# Altium project STM32F103C8T6.PrjPcb
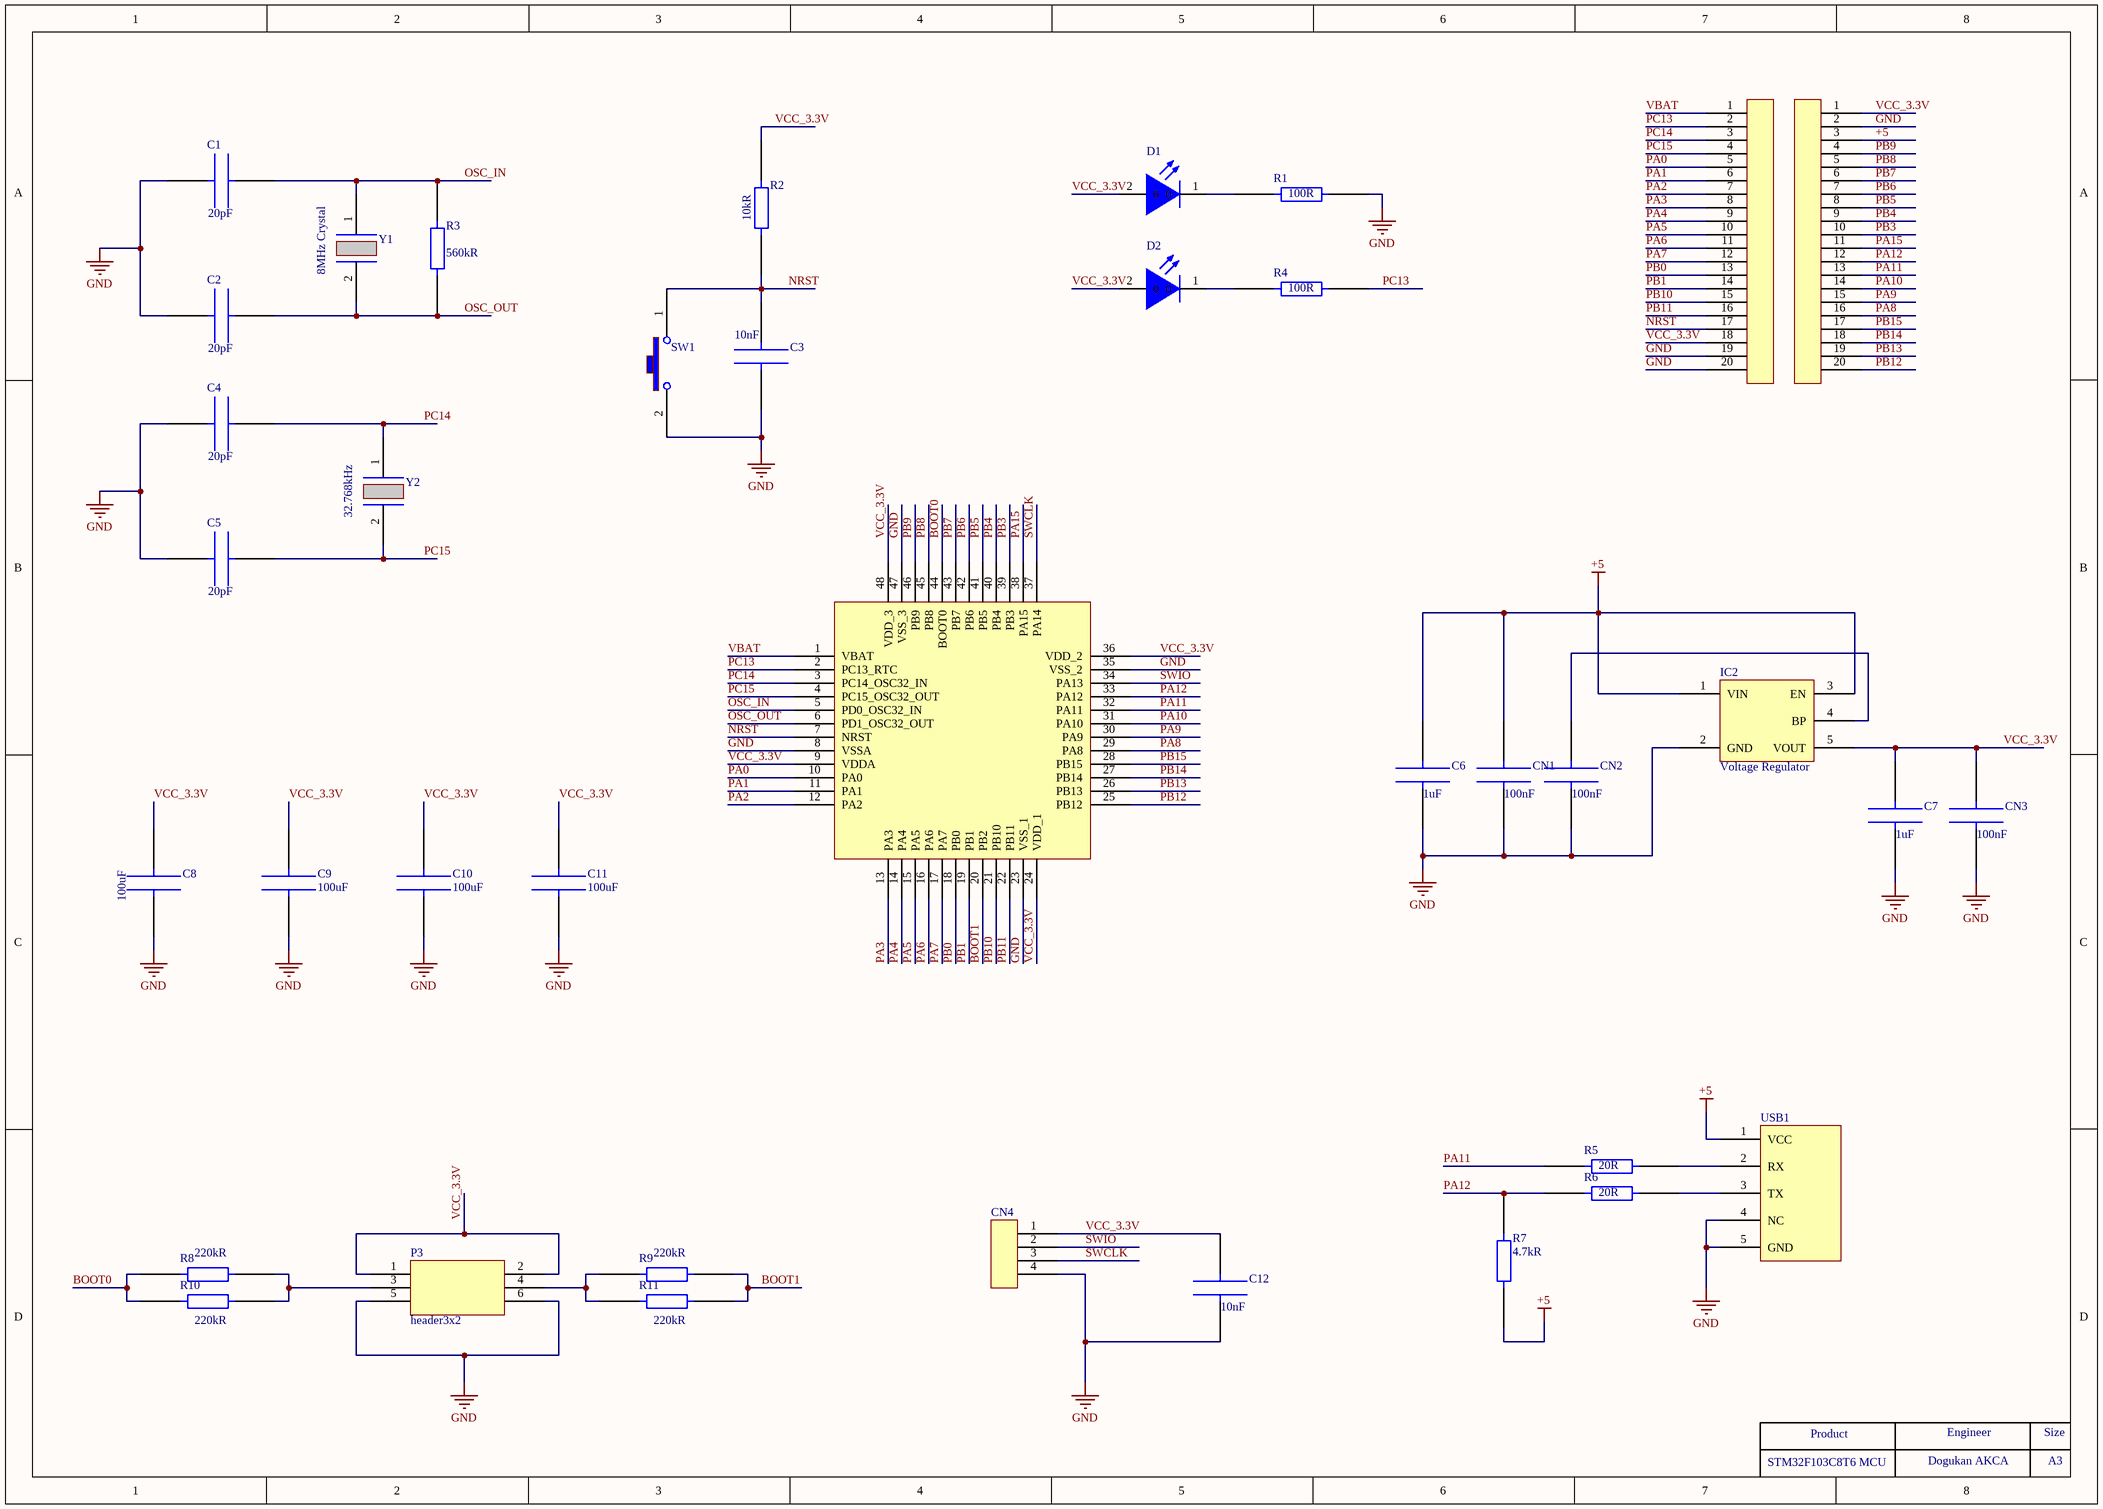
[diagram p0: STM32F103C8T6_Schematic.SchDoc]
1 sheet, 38 parts. Net scope: global (net labels, ports and power ports of the same name join across sheets).
Board file: STM32F103C8T6_PCB.PcbDoc

## Sheet STM32F103C8T6_Schematic.SchDoc
size A3

### Parts
C1  Capacitance: 20pF  [0603_CAP]  (hidden comment: CAP CER 20PF 50V C0G/NP0 0603)
C2  Capacitance: 20pF  [0603_CAP]  (hidden comment: CAP CER 20PF 50V C0G/NP0 0603)
C3  Capacitance: 10nF  [0603_CAP]  (hidden comment: CAP CER 10nF 50V X7R 0603)
C4  Capacitance: 20pF  [0603_CAP]  (hidden comment: CAP CER 20PF 50V C0G/NP0 0603)
C5  Capacitance: 20pF  [0603_CAP]  (hidden comment: CAP CER 20PF 50V C0G/NP0 0603)
C6  Capacitance: 1uF  [CAP_0805]  (hidden comment: CAP CER 1UF 0805)
C7  Capacitance: 1uF  [CAP_0805]  (hidden comment: CAP CER 1UF 0805)
C8  Capacitance: 100uF  [CAP_0805]  (hidden comment: CAP CER 100uf MLCC)
C9  Capacitance: 100uF  [CAP_0805]  (hidden comment: CAP CER 100uf MLCC)
C10  Capacitance: 100uF  [CAP_0805]  (hidden comment: CAP CER 100uf MLCC)
C11  Capacitance: 100uF  [CAP_0805]  (hidden comment: CAP CER 100uf MLCC)
C12  Capacitance: 10nF  [0603_CAP]  (hidden comment: CAP CER 10nF 50V X7R 0603)
CN1  Capacitance: 100nF  [0603_CAP]  (hidden comment: C0603 0.1uf)
CN2  Capacitance: 100nF  [0603_CAP]  (hidden comment: C0603 0.1uf)
CN3  Capacitance: 100nF  [0603_CAP]  (hidden comment: C0603 0.1uf)
CN4  CONN HDR STRIP SOLDER 4POS GOLD  [4 pin konnektor pin]  (value not drawn)
D1  LED GREEN CLEAR CHIP SMD  [0805_LED_GREEN]  (value not drawn)
D2  LED GREEN CLEAR CHIP SMD  [0805_LED_GREEN]  (value not drawn)
IC1  IC MCU 32BIT 64KB FLASH 48LQFP  [LQFP48]  (value not drawn)
IC2  Category: Voltage Regulator  [SOT23-5]  (hidden comment: IC REG LINEAR 3.3V 300MA SOT23-5)
P1  CONN SIL HDR MALE PIN 20POS TIN  [20pin1x20_header_connector]  (value not drawn)
P2  CONN SIL HDR MALE PIN 20POS TIN  [20pin1x20_header_connector]  (value not drawn)
P3  header3x2  [header3x2]
R1  100R  [0603_RES]
R2  Resistance: 10kR  [0603_RES]  (hidden comment: RES 10K OHM 0.5% 1/10W 0603)
R3  Resistance: 560kR  [0603_RES]  (hidden comment: RES 560K OHM 5% 1/10W 0603)
R4  100R  [0603_RES]
R5  R: 20R  [0603_RES]  (hidden comment: *RES 20 OHM 5% 1/10W 0603)
R6  R: 20R  [0603_RES]  (hidden comment: *RES 20 OHM 5% 1/10W 0603)
R7  Resistance: 4.7kR  [0603_RES]  (hidden comment: RES 4.7K OHM 5% 1/10W 0603)
R8  Resistance: 220kR  [0603_RES]  (hidden comment: RES 220K OHM 5% 1/10W 0603)
R9  Resistance: 220kR  [0603_RES]  (hidden comment: RES 220K OHM 5% 1/10W 0603)
R10  Resistance: 220kR  [0603_RES]  (hidden comment: RES 220K OHM 5% 1/10W 0603)
R11  Resistance: 220kR  [0603_RES]  (hidden comment: RES 220K OHM 5% 1/10W 0603)
SW1  push button switch  [push_button]  (value not drawn)
USB1  CONN RCPT USB2.0 MICRO B SMD R/A  [MICRO B USB2.0 SMD R/A]  (value not drawn)
Y1  Category: 8MHz Crystal  [USX SMD T_8MHz Crystal]  (hidden comment: CRYSTAL 8.0000MHZ 18PF SMD)
Y2  Frequency: 32.768kHz  [2-SMD_CRYSTAL 32.7680KHZ]  (hidden comment: CRYSTAL 32.7680KHZ 12.5PF SMD)

### Nets
+5: C6.2 CN1.2 IC2.1(VIN) IC2.3(EN) P2.3 R7.1 USB1.1(VCC)
GND: C1.1 C2.1 C3.1 C4.1 C5.1 C6.1 C7.1 C8.1 C9.1 C10.1 C11.1 C12.1 CN1.1 CN2.1 CN3.1 CN4.4 IC1.8(VSSA) IC1.23(VSS_1) IC1.35(VSS_2) IC1.47(VSS_3) IC2.2(GND) P1.19 P1.20 P2.2 P3.5 P3.6 R1.2 SW1.2 USB1.4(NC) USB1.5(GND)
BOOT0: IC1.44(BOOT0) R8.1 R10.1
BOOT1: IC1.20(PB2) R9.2 R11.2
NRST: C3.2 IC1.7(NRST) P1.17 R2.1 SW1.1
OSC_IN: C1.2 IC1.5(PD0_OSC32_IN) R3.2 Y1.1
OSC_OUT: C2.2 IC1.6(PD1_OSC32_OUT) R3.1 Y1.2
PA0: IC1.10(PA0) P1.5
PA1: IC1.11(PA1) P1.6
PA2: IC1.12(PA2) P1.7
PA3: IC1.13(PA3) P1.8
PA4: IC1.14(PA4) P1.9
PA5: IC1.15(PA5) P1.10
PA6: IC1.16(PA6) P1.11
PA7: IC1.17(PA7) P1.12
PA8: IC1.29(PA8) P2.16
PA9: IC1.30(PA9) P2.15
PA10: IC1.31(PA10) P2.14
PA11: IC1.32(PA11) P2.13 R5.1
PA12: IC1.33(PA12) P2.12 R6.1 R7.2
PA15: IC1.38(PA15) P2.11
PB0: IC1.18(PB0) P1.13
PB1: IC1.19(PB1) P1.14
PB3: IC1.39(PB3) P2.10
PB4: IC1.40(PB4) P2.9
PB5: IC1.41(PB5) P2.8
PB6: IC1.42(PB6) P2.7
PB7: IC1.43(PB7) P2.6
PB8: IC1.45(PB8) P2.5
PB9: IC1.46(PB9) P2.4
PB10: IC1.21(PB10) P1.15
PB11: IC1.22(PB11) P1.16
PB12: IC1.25(PB12) P2.20
PB13: IC1.26(PB13) P2.19
PB14: IC1.27(PB14) P2.18
PB15: IC1.28(PB15) P2.17
PC13: IC1.2(PC13_RTC) P1.2 R4.2
PC14: C4.2 IC1.3(PC14_OSC32_IN) P1.3 Y2.1
PC15: C5.2 IC1.4(PC15_OSC32_OUT) P1.4 Y2.2
SWCLK: CN4.3 IC1.37(PA14)
SWIO: CN4.2 IC1.34(PA13)
VBAT: IC1.1(VBAT) P1.1
VCC_3.3V: C7.2 C8.2 C9.2 C10.2 C11.2 C12.2 CN3.2 CN4.1 D1.2(0) D2.2(0) IC1.9(VDDA) IC1.24(VDD_1) IC1.36(VDD_2) IC1.48(VDD_3) IC2.5(VOUT) P1.18 P2.1 P3.1 P3.2 R2.2
NetCN2_2: CN2.2 IC2.4(BP)
NetD1_1: D1.1(0) R1.1
NetD2_1: D2.1(0) R4.1
NetP3_3: P3.3 R8.2 R10.2
NetP3_4: P3.4 R9.1 R11.1
NetR5_2: R5.2 USB1.2(RX)
NetR6_2: R6.2 USB1.3(TX)

### Notes on the sheet
- Product
- Dogukan AKCA
- Engineer
- Size
- A3
- STM32F103C8T6 MCU
- Title
- Size:
- Date:
- Number:
- Time:
- Revision:
- Sheet
- of
- File:

### Library data of the parts
C1 C2 C4 C5 = CAP CER 20PF 50V C0G/NP0 0603: Manufacturer: Samsung; Manufacturer Part Number: CL10C200JB8NNNC; Designer: Dogukan; Tolerance: 5%; Dielectric: C0G; Temperature Coefficient: 300ppm/°C; Supplier 1: Digi-Key; RoHS: Yes; Category: Ceramic Capacitors; Stock 1: 464918; Pricing 1: 1=0,1, 10=0,044, 50=0,0238, 100=0,0194, 500=0,01386, 1000=0,01089 (USD); Mount: Surface Mount; Case/Package: 0603; Case Code (Metric): 1608; Case Code (Imperial): 0603; Min Operating Temperature: -55°C; Max Operating Temperature: 125°C; Package Quantity: 1; Packaging: Tape and Reel; Voltage Rating: 50V; Voltage: 50V; Series: CL; Construction: Flat; Length: 1.6mm; Width: 0.031inch; Height: 0.8mm; Thickness: 0.035inch; Depth: 0.8mm; Radiation Hardening: No; RoHS Compliant: Yes; ComponentLink1URL: https://datasheet.ciiva.com/26877/getdatasheetpartid-640634-26877974.pdf?src-supplier=Verical; ComponentLink1Description: https://datasheet.ciiva.com/26877/getdatasheetpartid-640634-26877974.pdf?src-supplier=Verical; ComponentLink2URL: https://datasheet.ciiva.com/26310/mlcc-catalogdownload2013-eng-26310315.pdf?src-supplier=Distrelec; ComponentLink2Description: https://datasheet.ciiva.com/26310/mlcc-catalogdownload2013-eng-26310315.pdf?src-supplier=Distrelec; Supplier Part Number 1: 1276-1187-1-ND
C3 C12 = CAP CER 10nF 50V X7R 0603: Cap Ceramic 0.01uF 50V X7R 5% SMD 0603 125C Paper T/R; Manufacturer: Yageo; Manufacturer Part Number: CC0603JPX7R9BB103; Designer: Dogukan; Supplier 1: Digi-Key; RoHS: Yes; Category: Ceramic Capacitors; Stock 1: 51472; Pricing 1: 1=0,1, 10=0,048, 50=0,0262, 100=0,0214, 500=0,0153, 1000=0,01203, 2500=0,01093, 5000=0,01006 (USD); Case/Package: 0603; Case Code (Imperial): 0603; Case Code (Metric): 1608; Weight: 7.1E-05oz; Min Operating Temperature: -55°C; Max Operating Temperature: 125°C; Packaging: Tape and Reel; Voltage Rating (DC): 50V; Tolerance: 5%; Dielectric: X7R; Termination: SMD/SMT; Lead Free: Lead Free; Halogen Free: Halogen Free; RoHS Compliant: Yes; ComponentLink1URL: http://www.mouser.com/ds/2/447/UPY-GPHC_X7R_6.3V-to-50V_10-595240.pdf?src-supplier=Mouser; ComponentLink1Description: http://www.mouser.com/ds/2/447/UPY-GPHC_X7R_6.3V-to-50V_10-595240.pdf?src-supplier=Mouser; Supplier Part Number 1: 13-CC0603JPX7R9BB103CT-ND
C6 C7 = CAP CER 1UF 0805: CAP CER 1UF 50V X7R 0805; Manufacturer: Samsung; Manufacturer Part Number: CL21B105KBFNNNE; Designer: Dogukan; Tolerance: 10%; Supplier 1: Digi-Key; RoHS: Yes; Category: Ceramic Capacitors; Stock 1: 145892; Pricing 1: 1=0,11, 10=0,079, 50=0,045, 100=0,0373, 500=0,02616, 1000=0,02165 (USD); Mount: Surface Mount; Case/Package: 0805; Case Code (Metric): 2012; Case Code (Imperial): 0805; Min Operating Temperature: -55°C; Max Operating Temperature: 125°C; Packaging: Tape and Reel; Package Quantity: 1; Voltage Rating: 50V; Dielectric: X7R; Voltage: 50V; Series: CL; Construction: Flat; Length: 2mm; Width: 0.049inch; Height: 1.25mm; Thickness: 0.053inch; Depth: 1.25mm; Radiation Hardening: No; RoHS Compliant: Yes; ComponentLink1URL: https://datasheet.ciiva.com/25800/cl21b105kbfnnne-25800291.pdf?src-supplier=Digi-Key; ComponentLink1Description: https://datasheet.ciiva.com/25800/cl21b105kbfnnne-25800291.pdf?src-supplier=Digi-Key; Supplier Part Number 1: 1276-1029-1-ND
C8-C11 = CAP CER 100uf MLCC: Cap 100UF 4VDC Z6S 20% SMD 0805 Embossed Tape; Manufacturer: Murata; Manufacturer Part Number: GRM21BC80G107ME15K; Designer: Dogukan; Voltage Rating (DC): 4V; Dielectric: X6S; Supplier 1: Digi-Key; RoHS: Yes; Category: Ceramic Capacitors; Stock 1: 76129; Pricing 1: 1=0,94, 10=0,715, 50=0,5938, 100=0,5114, 500=0,3959, 1000=0,34092, 2500=0,31892, 5000=0,30243 (USD); Tolerance: 20%; Length: 2mm; Width: 1.25mm; Thickness: 1.25mm; RoHS Compliant: Yes; Supplier Part Number 1: 490-GRM21BC80G107ME15KCT-ND
CN1-CN3 = C0603 0.1uf: Multilayer Ceramic Capacitors (MLCC) - SMD/SMT 50volts 0.1uF X7R 10%; Manufacturer: KEMET; Manufacturer Part Number: C0603C104K5RACTU; Voltage Rating: 50V; Designer: Dogukan; Supplier 1: Digi-Key; RoHS: Yes; Category: Ceramic Capacitors; Stock 1: 9369813; Pricing 1: 1=0,11, 10=0,078, 50=0,0424, 100=0,0346, 500=0,02474, 1000=0,01944 (USD); Mount: Surface Mount; Case/Package: 0603; Min Operating Temperature: -55°C; Max Operating Temperature: 125°C; Tolerance: 10%; Packaging: Tape and Reel; Dielectric: X7R; Series: SMD Comm X7R; Voltage: 50V; Length: 0.063inch; Width: 0.031inch; Thickness: 0.034inch; RoHS Compliant: Yes; Supplier Part Number 1: 399-C0603C104K5RAC7867CT-ND
CN4 = KONNEKTOR 4POS: Headers & Wire Housings Low Profile RT Angle Solder Cup Header; Manufacturer: Mill-Max; Manufacturer Part Number: 380-10-104-10-003000; Designer: Dogukan; Supplier 1: Digi-Key; RoHS: No; Category: Connectors; Stock 1: 609; Pricing 1: 1=6,26, 10=5,684, 100=5,0076, 500=4,25644, 1000=3,6305 (USD); ComponentLink1URL: https://www.mill-max.com/assets/pdfs/047.2.PDF?src-supplier=Digi-Key; ComponentLink1Description: https://www.mill-max.com/assets/pdfs/047.2.PDF?src-supplier=Digi-Key; ComponentLink2URL: https://datasheet.octopart.com/380-10-104-10-003000-Mill-Max-datasheet-155418866.pdf?src-supplier=Sager+Electronics; ComponentLink2Description: https://datasheet.octopart.com/380-10-104-10-003000-Mill-Max-datasheet-155418866.pdf?src-supplier=Sager+Electronics; Supplier Part Number 1: ED10093-ND
D1 D2 = LED GREEN CLEAR CHIP SMD: Green 569nm LED Indication - Discrete 2.1V 0805 (2012 Metric); Manufacturer: Vishay Lite-On; Manufacturer Part Number: LTST-C171GKT; Designer: Dogukan; Lens Color: Colorless; Viewing Angle: 130°; Lens Style: Flat,Diffused,Colorless,Rectangular,Clear; Luminous Intensity: 12mcd; Forward Current: 30mA; Power Rating: 100mW; Test Current: 10mA; Number of Elements: 1; Wavelength: 585nm; Reverse Voltage: 5V; Lens Size: 1.25mm; Supplier 1: Digi-Key; RoHS: Yes; Category: LEDs; Stock 1: 213944; Pricing 1: 1=0,26, 10=0,143, 100=0,0663, 500=0,0612, 1000=0,04794 (USD); Mount: Surface Mount; Case/Package: 0805; Number of Pins: 2; Color: Green; Case Code (Metric): 2012; Case Code (Imperial): 0805; Min Operating Temperature: -55°C; Max Operating Temperature: 85°C; Package Quantity: 3000; Packaging: Tape and Reel; Forward Voltage: 2.1V; Illumination Color: Green; Dominant Wavelength: 569nm; Lens Transparency: Clear; Power Dissipation: 100mW; Number of LEDs: 1; Series: -; Length: 2mm; Width: 1.25mm; Height: 0.9mm; Depth: 1.25mm; Radiation Hardening: No; Lead Free: Lead Free; RoHS Compliant: Yes; ComponentLink1URL: https://datasheet.ciiva.com/11773/0900766b80dc0296-11773991.pdf?src-supplier=Rs; ComponentLink1Description: https://datasheet.ciiva.com/11773/0900766b80dc0296-11773991.pdf?src-supplier=Rs; ComponentLink2URL: https://datasheet.ciiva.com/2110/ltst-c171gkt-2110000.pdf?src-supplier=Digi-Key; ComponentLink2Description: https://datasheet.ciiva.com/2110/ltst-c171gkt-2110000.pdf?src-supplier=Digi-Key; ComponentLink3URL: https://datasheet.ciiva.com/12400/lite-on-ltst-c171gkt-190133-12400647.pdf?src-supplier=Mouser; ComponentLink3Description: https://datasheet.ciiva.com/12400/lite-on-ltst-c171gkt-190133-12400647.pdf?src-supplier=Mouser; ComponentLink4URL: https://datasheet.ciiva.com/2110/ltst-c171gkt-2110001.pdf?src-supplier=Digi-Key; ComponentLink4Description: https://datasheet.ciiva.com/2110/ltst-c171gkt-2110001.pdf?src-supplier=Digi-Key; ComponentLink5URL: https://datasheet.ciiva.com/2110/ltst-c171gkt-2110002.pdf?src-supplier=Digi-Key; ComponentLink5Description: https://datasheet.ciiva.com/2110/ltst-c171gkt-2110002.pdf?src-supplier=Digi-Key; ComponentLink6URL: https://datasheet.ciiva.com/16396/ltst-c171gkt-16396549.pdf?src-supplier=Future+Electronics; ComponentLink6Description: https://datasheet.ciiva.com/16396/ltst-c171gkt-16396549.pdf?src-supplier=Future+Electronics; Supplier Part Number 1: 160-1423-1-ND
IC1 = STM32F103C8T6: ARM Cortex-M3 STM32 F1 Microcontroller 32-Bit 72MHz 64kB FLASH LQFP48 STM32F103C8T6; Manufacturer: STMicroelectronics; Designer: Dogukan; ComponentLink1URL: https://datasheet.ciiva.com/8054/1730126-8054942.pdf?src-supplier=Element14; ComponentLink1Description: https://datasheet.ciiva.com/8054/1730126-8054942.pdf?src-supplier=Element14; ComponentLink2URL: https://datasheet.ciiva.com/14100/pustm-arm-microcont-stm32f103-en-14100508.pdf?src-supplier=Distrelec; ComponentLink2Description: https://datasheet.ciiva.com/14100/pustm-arm-microcont-stm32f103-en-14100508.pdf?src-supplier=Distrelec; Supplier 1: Digi-Key; RoHS: Yes; Category: Microcontrollers; Pricing 1: 1=6,42, 25=5,5256, 100=4,7979, 500=4,17798, 2500=3,5672 (USD); Supplier Part Number 1: 497-6063-ND; Manufacturer Part Number: STM32F103C8T6
IC2 = Voltage Regulator_5V->3.3V: IC REG LDO 3.3V 0.3A SOT23-5; Manufacturer: Richtek; Manufacturer Part Number: RT9193-33GB; Designer: Dogukan; Supplier 1: Digi-Key; RoHS: Yes; Stock 1: 15060; Pricing 1: 1=0,55, 10=0,468, 25=0,4368, 100=0,3494, 250=0,32448, 500=0,27456, 1000=0,21216 (USD); ComponentLink1URL: https://datasheet.ciiva.com/2046/3d3futf-83fb3frfm5mtkzlte2lnbkzg3d3d3f3d-2046896.pdf?src-supplier=Digi-Key; ComponentLink1Description: https://datasheet.ciiva.com/2046/3d3futf-83fb3frfm5mtkzlte2lnbkzg3d3d3f3d-2046896.pdf?src-supplier=Digi-Key; ComponentLink2URL: https://datasheet.ciiva.com/28652/1782157-28652989.pdf?src-supplier=Element14; ComponentLink2Description: https://datasheet.ciiva.com/28652/1782157-28652989.pdf?src-supplier=Element14; Supplier Part Number 1: 1028-1014-1-ND
P1 P2 = header_20pin: 2.54mm (0.1") Pitch SIL Vertical Through Connect Header Strip, tin (hi-temp mould), 20 contacts; Manufacturer: Harwin; Manufacturer Part Number: D01-9922046; Designer: Dogukan; Supplier 1: Digi-Key; RoHS: Yes; Category: Headers and Wire Housings; Stock 1: 1140; Pricing 1: 1=4,9, 100=3,1066, 500=2,6656, 2500=2,37161 (USD); ComponentLink1URL: https://datasheet.ciiva.com/9479/d01-992-9479968.pdf?src-supplier=Avnet; ComponentLink1Description: https://datasheet.ciiva.com/9479/d01-992-9479968.pdf?src-supplier=Avnet; ComponentLink2URL: https://datasheet.ciiva.com/11747/0900766b8078dcb7-11747631.pdf?src-supplier=Rs; ComponentLink2Description: https://datasheet.ciiva.com/11747/0900766b8078dcb7-11747631.pdf?src-supplier=Rs; ComponentLink3URL: https://datasheet.ciiva.com/7639/111680-7639719.pdf?src-supplier=Element14; ComponentLink3Description: https://datasheet.ciiva.com/7639/111680-7639719.pdf?src-supplier=Element14; ComponentLink4URL: https://datasheet.ciiva.com/6783/d01-992-6783401.pdf?src-supplier=Digi-Key; ComponentLink4Description: https://datasheet.ciiva.com/6783/d01-992-6783401.pdf?src-supplier=Digi-Key; Supplier Part Number 1: 952-1900-ND
P3 = header3x2: Designer: Dogukan
R1 R4 = RES_100R_0603: Res Thick Film 0603 100 Ohm 1% 1/10W ±100ppm/°C Molded SMD Paper T/R; Manufacturer: Yageo; Manufacturer Part Number: RC0603FR-07100RL; Designer: Dogukan; Max Power Dissipation: 100mW; Voltage Rating (DC): 50V; Supplier 1: Digi-Key; RoHS: Yes; Category: Chip SMD Resistors; Stock 1: 7267655; Pricing 1: 1=0,1, 10=0,018, 50=0,0106, 100=0,0088, 500=0,00592, 1000=0,00505 (USD); Case/Package: 0603; Number of Pins: 2; Case Code (Imperial): 0603; Case Code (Metric): 1608; Size Code: 0603; Min Operating Temperature: -55°C; Max Operating Temperature: 155°C; Resistance: 100R; Tolerance: 1%; Packaging: Tape and Reel; Temperature Coefficient: 100ppm/°C; Series: RC; Number of Terminations: 2; Features: Moisture Resistant; Power Rating: 100mW; Termination: SMD/SMT; Voltage Rating: 50V; Resistor Type: Thick Film; Construction: Rectangular; Technology: THICK FILM; Resistance Tolerance: 1%; Length: 1.6mm; Width: 0.8mm; Height: 0.45mm; Depth: 0.8mm; RoHS Compliant: Yes; Lead Free: Lead Free; Military Standard: Not; Reach SVHC Compliant: Unknown; ComponentLink1URL: https://datasheet.ciiva.com/7660/38590-7660788.pdf?src-supplier=Element14; ComponentLink1Description: https://datasheet.ciiva.com/7660/38590-7660788.pdf?src-supplier=Element14; ComponentLink2URL: https://datasheet.ciiva.com/11808/0900766b80f96399-11808280.pdf?src-supplier=Rs; ComponentLink2Description: https://datasheet.ciiva.com/11808/0900766b80f96399-11808280.pdf?src-supplier=Rs; ComponentLink3URL: https://datasheet.ciiva.com/22747/443971-22747518.pdf?src-supplier=Element14; ComponentLink3Description: https://datasheet.ciiva.com/22747/443971-22747518.pdf?src-supplier=Element14; ComponentLink4URL: https://datasheet.ciiva.com/46440/1868787-46440890.pdf?src-supplier=Element14; ComponentLink4Description: https://datasheet.ciiva.com/46440/1868787-46440890.pdf?src-supplier=Element14; ComponentLink5URL: https://datasheet.ciiva.com/7746/1738695-7746238.pdf?src-supplier=Element14; ComponentLink5Description: https://datasheet.ciiva.com/7746/1738695-7746238.pdf?src-supplier=Element14; ComponentLink6URL: https://datasheet.ciiva.com/7746/1738695-7746237.pdf?src-supplier=Element14; ComponentLink6Description: https://datasheet.ciiva.com/7746/1738695-7746237.pdf?src-supplier=Element14; Supplier Part Number 1: 311-100HRDKR-ND
R2 = RES 10K OHM 0.5% 1/10W 0603: Res Thin Film 0603 10K Ohm 0.5% 1/10W ±25ppm/°C Molded SMD Paper T/R; Manufacturer: Yageo; Manufacturer Part Number: RT0603DRD0710KL; Designer: Dogukan; Power Rating: 100mW; Voltage Rating (DC): 50V; Supplier 1: Digi-Key; RoHS: Yes; Category: Chip SMD Resistors; Stock 1: 1584873; Pricing 1: 1=0,18, 10=0,151, 100=0,0592, 500=0,0358, 1000=0,02478, 2500=0,02271 (USD); Case/Package: 0603; Case Code (Imperial): 0603; Case Code (Metric): 1608; Size Code: 0603; Min Operating Temperature: -55°C; Max Operating Temperature: 155°C; Tolerance: 0.5%; Packaging: Cut Tape; Temperature Coefficient: 25ppm/°C; Series: RT; Max Power Dissipation: 100mW; Number of Terminations: 2; Width: 800um; Lead Free: Lead Free; RoHS Compliant: Yes; ComponentLink1URL: http://www.yageo.com/documents/recent/PYu-RT_1-to-0.01_RoHS_L_9.pdf?src-supplier=Digi-Key; ComponentLink1Description: http://www.yageo.com/documents/recent/PYu-RT_1-to-0.01_RoHS_L_9.pdf?src-supplier=Digi-Key; ComponentLink2URL: http://www.yageo.com/documents/recent/PYu-RT_1-to-0.05_RoHS_L_(4).pdf?src-supplier=Future+Electronics; ComponentLink2Description: http://www.yageo.com/documents/recent/PYu-RT_1-to-0.05_RoHS_L_(4).pdf?src-supplier=Future+Electronics; Supplier Part Number 1: 311-10KDCT-ND
R3 = RES 560K OHM 5% 1/10W 0603: Res Thick Film 0603 560K Ohm 5% 0.1W(1/10W) ±100ppm/C Molded SMD Paper T/R; Manufacturer: Yageo; Manufacturer Part Number: RC0603JR-07560KL; Designer: Dogukan; Power Rating: 100mW; Voltage Rating: 75V; Voltage Rating (DC): 50V; Temperature Coefficient: 100ppm/°C; Supplier 1: Digi-Key; RoHS: Yes; Category: Chip SMD Resistors; Stock 1: 503891; Pricing 1: 1=0,1, 10=0,014, 50=0,0088, 100=0,0073, 500=0,00486, 1000=0,00415 (USD); Case/Package: 0603; Number of Pins: 2; Case Code (Metric): 1608; Case Code (Imperial): 0603; Weight: 7.1E-05oz; Min Operating Temperature: -55°C; Max Operating Temperature: 155°C; Package Quantity: 1; Tolerance: 5%; Packaging: Tape and Reel; Resistor Type: Thick Film; Number of Terminations: 2; Termination: SMD/SMT; Max Power Dissipation: 100mW; Working Voltage: 75V; Features: Moisture Resistant; Series: RC; Resistance Tolerance: 5%; Technology: THICK FILM; Length: 0.063inch; Width: 0.8mm; Height: 0.022inch; Lead Free: Lead Free; RoHS Compliant: Yes; Reach SVHC Compliant: Unknown; ComponentLink1URL: https://datasheet.ciiva.com/2453/pyu-r-int-thick-7-2453056.pdf?src-supplier=Digi-Key; ComponentLink1Description: https://datasheet.ciiva.com/2453/pyu-r-int-thick-7-2453056.pdf?src-supplier=Digi-Key; ComponentLink2URL: https://datasheet.ciiva.com/2453/pyu-r-int-thick-7-2453057.pdf?src-supplier=Digi-Key; ComponentLink2Description: https://datasheet.ciiva.com/2453/pyu-r-int-thick-7-2453057.pdf?src-supplier=Digi-Key; ComponentLink3URL: https://datasheet.ciiva.com/2453/pyu-r-int-thick-7-2453055.pdf?src-supplier=Digi-Key; ComponentLink3Description: https://datasheet.ciiva.com/2453/pyu-r-int-thick-7-2453055.pdf?src-supplier=Digi-Key; Supplier Part Number 1: 311-560KGRCT-ND
R5 R6 = RES 20 OHM 5% 1/10W 0603: Res Thick Film 0603 20 Ohm 5% 1/10W +/-100ppm/ßC Molded SMD Paper T/R; Manufacturer: Yageo; Manufacturer Part Number: RC0603JR-0720RL; Designer: Dogukan; Supplier 1: Digi-Key; RoHS: Yes; Category: Chip SMD Resistors; Stock 1: 1380627; Pricing 1: 1=0,1, 10=0,014, 50=0,0088, 100=0,0073, 500=0,00486, 1000=0,00415 (USD); ComponentLink1URL: https://datasheet.ciiva.com/2453/pyu-r-int-thick-7-2453211.pdf?src-supplier=Digi-Key; ComponentLink1Description: https://datasheet.ciiva.com/2453/pyu-r-int-thick-7-2453211.pdf?src-supplier=Digi-Key; ComponentLink2URL: https://datasheet.ciiva.com/2453/pyu-r-int-thick-7-2453212.pdf?src-supplier=Digi-Key; ComponentLink2Description: https://datasheet.ciiva.com/2453/pyu-r-int-thick-7-2453212.pdf?src-supplier=Digi-Key; ComponentLink3URL: https://datasheet.ciiva.com/2453/pyu-r-int-thick-7-2453213.pdf?src-supplier=Digi-Key; ComponentLink3Description: https://datasheet.ciiva.com/2453/pyu-r-int-thick-7-2453213.pdf?src-supplier=Digi-Key; Supplier Part Number 1: 311-20GRCT-ND
R7 = RES 4.7K OHM 5% 1/10W 0603: Res General Purpose Thick Film 0603 4.7k Ohm 5% 1/10W ±100ppm/°C Molded Paper T/R; Manufacturer: Yageo; Manufacturer Part Number: RC0603JR-074K7L; Designer: Dogukan; Voltage Rating (DC): 50V; Power Rating: 100mW; Supplier 1: Digi-Key; RoHS: Yes; Category: Chip SMD Resistors; Stock 1: 7404081; Pricing 1: 1=0,1, 10=0,014, 50=0,0088, 100=0,0073, 500=0,00486, 1000=0,00415 (USD); Case/Package: 0603; Number of Pins: 2; Case Code (Imperial): 0603; Case Code (Metric): 1608; Size Code: 0603; Min Operating Temperature: -55°C; Max Operating Temperature: 155°C; Resistor Type: Thick Film; Tolerance: 5%; Packaging: Tape and Reel; Temperature Coefficient: 100ppm/°C; Voltage Rating: 50V; Termination: SMD/SMT; Features: Moisture Resistant; Max Power Dissipation: 100mW; Number of Terminations: 2; Series: RC; Resistance Tolerance: 5%; Construction: Rectangular; Length: 1.6mm; Width: 0.8mm; Depth: 0.8mm; Reach SVHC Compliant: No; Lead Free: Lead Free; RoHS Compliant: Yes; Military Standard: Not; ComponentLink1URL: https://datasheet.ciiva.com/46412/443971-46412858.pdf?src-supplier=Element14; ComponentLink1Description: https://datasheet.ciiva.com/46412/443971-46412858.pdf?src-supplier=Element14; Supplier Part Number 1: 311-4.7KGRCT-ND
R8-R11 = RES 220K OHM 5% 1/10W 0603: Res Thick Film 0603 220K Ohm 5% 0.1W(1/10W) ±100ppm/C Pad SMD T/R; Manufacturer: Yageo; Manufacturer Part Number: RC0603JR-07220KL; Designer: Dogukan; Temperature Coefficient: 100ppm/°C; Voltage Rating (DC): 50V; Power Rating: 100mW; Supplier 1: Digi-Key; RoHS: Yes; Category: Chip SMD Resistors; Stock 1: 1084932; Pricing 1: 1=0,1, 10=0,014, 50=0,0088, 100=0,0073, 500=0,00486, 1000=0,00415 (USD); Case/Package: 0603; Number of Pins: 2; Case Code (Imperial): 0603; Case Code (Metric): 1608; Size Code: 0603; Min Operating Temperature: -55°C; Max Operating Temperature: 155°C; Resistor Type: Thick Film; Tolerance: 5%; Packaging: Tape and Reel; Voltage Rating: 50V; Package Quantity: 1; Termination: SMD/SMT; Number of Terminations: 2; Max Power Dissipation: 100mW; Features: Moisture Resistant; Series: RC; Construction: Rectangular; Resistance Tolerance: 5%; Length: 0.063inch; Width: 0.031inch; Height: 0.022inch; Depth: 0.8mm; Reach SVHC Compliant: No; Lead Free: Lead Free; RoHS Compliant: Yes; Military Standard: Not; ComponentLink1URL: https://datasheet.ciiva.com/2452/pyu-r-int-thick-7-2452925.pdf?src-supplier=Digi-Key; ComponentLink1Description: https://datasheet.ciiva.com/2452/pyu-r-int-thick-7-2452925.pdf?src-supplier=Digi-Key; ComponentLink2URL: https://datasheet.ciiva.com/2452/pyu-r-int-thick-7-2452923.pdf?src-supplier=Digi-Key; ComponentLink2Description: https://datasheet.ciiva.com/2452/pyu-r-int-thick-7-2452923.pdf?src-supplier=Digi-Key; ComponentLink3URL: https://datasheet.ciiva.com/2452/pyu-r-int-thick-7-2452924.pdf?src-supplier=Digi-Key; ComponentLink3Description: https://datasheet.ciiva.com/2452/pyu-r-int-thick-7-2452924.pdf?src-supplier=Digi-Key; Supplier Part Number 1: 311-220KGRCT-ND
SW1 = push_button
USB1 = CONN RCPT USB2.0 MICRO B SMD R/A: CONN USB MICRO B RECPT SMT R/A; Manufacturer: Amphenol ICC / FCI; Manufacturer Part Number: 10118192-0001LF; Designer: Dogukan; Connector Type: USB,Receptacle; Number of Contacts: 5; Gender: Receptacle; Current Rating: 1.8A; Insulation Resistance: 1GR; Number of Ports: 1; Max Voltage Rating (AC): 100V; Pitch: 0.65mm; Supplier 1: Digi-Key; RoHS: No; Category: USB Connectors; Stock 1: 122306; Pricing 1: 1=0,46, 10=0,404, 25=0,3696, 50=0,3478, 100=0,3334, 250=0,30436, 500=0,28988 (USD); Mount: Surface Mount,Horizontal; Number of Pins: 5; Color: Black; Contact Material: Copper Alloy; Contact Plating: Gold; Housing Material: Polymer; Min Operating Temperature: -55°C; Max Operating Temperature: 85°C; Termination: Solder; Orientation: Right Angle; Features: Shielded; USB Standard: USB 2.0; Series: -; Packaging: Tape and Reel; Package Quantity: 1400; Voltage Rating: 100V; Length: 7.86mm; Depth: 5.57mm; Radiation Hardening: No; Flammability Rating: UL94 V-0; Reach SVHC Compliant: No; ComponentLink1URL: http://uk.rs-online.com/webdocs/1450/0900766b814507ee.pdf?src-supplier=Rs; ComponentLink1Description: http://uk.rs-online.com/webdocs/1450/0900766b814507ee.pdf?src-supplier=Rs; ComponentLink2URL: http://www.amphenol-icc.com/media/wysiwyg/files/drawing/10118192.pdf?src-supplier=Digi-Key; ComponentLink2Description: http://www.amphenol-icc.com/media/wysiwyg/files/drawing/10118192.pdf?src-supplier=Digi-Key; ComponentLink3URL: http://www.farnell.com/datasheets/2366786.pdf?src-supplier=Farnell; ComponentLink3Description: http://www.farnell.com/datasheets/2366786.pdf?src-supplier=Farnell; ComponentLink4URL: https://cdn.amphenol-icc.com/media/wysiwyg/files/documentation/datasheet/inputoutput/io_usb_micro.pdf?src-supplier=Verical; ComponentLink4Description: https://cdn.amphenol-icc.com/media/wysiwyg/files/documentation/datasheet/inputoutput/io_usb_micro.pdf?src-supplier=Verical; ComponentLink5URL: https://cdn.amphenol-icc.com/media/wysiwyg/files/documentation/datasheet/inputoutput/io_usb_micro.pdf?src-supplier=Arrow+Electronics; ComponentLink5Description: https://cdn.amphenol-icc.com/media/wysiwyg/files/documentation/datasheet/inputoutput/io_usb_micro.pdf?src-supplier=Arrow+Electronics; ComponentLink6URL: https://cdn.amphenol-icc.com/media/wysiwyg/files/documentation/datasheet/inputoutput/io_usb_micro.pdf?src-supplier=Avnet; ComponentLink6Description: https://cdn.amphenol-icc.com/media/wysiwyg/files/documentation/datasheet/inputoutput/io_usb_micro.pdf?src-supplier=Avnet; ComponentLink7URL: http://www.farnell.com/cad/1935767.pdf?src-supplier=Element14; ComponentLink7Description: http://www.farnell.com/cad/1935767.pdf?src-supplier=Element14; ComponentLink8URL: https://cdn.amphenol-icc.com/media/wysiwyg/files/documentation/datasheet/inputoutput/io_usb_micro.pdf?src-supplier=Allied+Electronics; ComponentLink8Description: https://cdn.amphenol-icc.com/media/wysiwyg/files/documentation/datasheet/inputoutput/io_usb_micro.pdf?src-supplier=Allied+Electronics; ComponentLink9URL: http://www.farnell.com/datasheets/2366786.pdf?src-supplier=Newark; ComponentLink9Description: http://www.farnell.com/datasheets/2366786.pdf?src-supplier=Newark; ComponentLink10URL: https://cdn.amphenol-icc.com/media/wysiwyg/files/documentation/datasheet/inputoutput/io_usb_micro.pdf?src-supplier=Mouser; ComponentLink10Description: https://cdn.amphenol-icc.com/media/wysiwyg/files/documentation/datasheet/inputoutput/io_usb_micro.pdf?src-supplier=Mouser; ComponentLink11URL: https://cdn.amphenol-icc.com/media/wysiwyg/files/documentation/datasheet/inputoutput/io_usb_micro.pdf?src-supplier=Freelance+Electronics; ComponentLink11Description: https://cdn.amphenol-icc.com/media/wysiwyg/files/documentation/datasheet/inputoutput/io_usb_micro.pdf?src-supplier=Freelance+Electronics; ComponentLink12URL: https://cdn.amphenol-icc.com/media/wysiwyg/files/documentation/datasheet/inputoutput/io_usb_micro.pdf?src-supplier=Heilind+Electronics; ComponentLink12Description: https://cdn.amphenol-icc.com/media/wysiwyg/files/documentation/datasheet/inputoutput/io_usb_micro.pdf?src-supplier=Heilind+Electronics; ComponentLink13URL: https://cdn.amphenol-icc.com/media/wysiwyg/files/documentation/datasheet/inputoutput/io_usb_micro.pdf?src-supplier=TME; ComponentLink13Description: https://cdn.amphenol-icc.com/media/wysiwyg/files/documentation/datasheet/inputoutput/io_usb_micro.pdf?src-supplier=TME; ComponentLink14URL: https://cdn.amphenol-icc.com/media/wysiwyg/files/documentation/datasheet/inputoutput/io_usb_micro.pdf?src-supplier=TTI; ComponentLink14Description: https://cdn.amphenol-icc.com/media/wysiwyg/files/documentation/datasheet/inputoutput/io_usb_micro.pdf?src-supplier=TTI; ComponentLink15URL: https://cdn.amphenol-icc.com/media/wysiwyg/files/documentation/datasheet/inputoutput/io_usb_micro.pdf?src-supplier=NAC+Semi; ComponentLink15Description: https://cdn.amphenol-icc.com/media/wysiwyg/files/documentation/datasheet/inputoutput/io_usb_micro.pdf?src-supplier=NAC+Semi; ComponentLink16URL: https://cdn.amphenol-icc.com/media/wysiwyg/files/documentation/datasheet/inputoutput/io_usb_micro.pdf?src-supplier=SOS+electronic; ComponentLink16Description: https://cdn.amphenol-icc.com/media/wysiwyg/files/documentation/datasheet/inputoutput/io_usb_micro.pdf?src-supplier=SOS+electronic; Supplier Part Number 1: 609-4613-1-ND
Y1 = CRYSTAL 8.0000MHZ 18PF SMD: Crystal 8MHz ±30ppm (Tol) ±50ppm (Stability) 18pF FUND 60Ohm 2-Pin HC-49/USX SMD T/R; Manufacturer: ECS International; Manufacturer Part Number: ECS-80-18-5PX-TR; Designer: Dogukan; Supplier 1: Digi-Key; RoHS: Yes; Stock 1: 115816; Pricing 1: 1=0,31, 10=0,259, 50=0,2328, 100=0,2068, 500=0,1965 (USD); ComponentLink1URL: https://datasheet.ciiva.com/852/csm-7x-852380.pdf?src-supplier=Digi-Key; ComponentLink1Description: https://datasheet.ciiva.com/852/csm-7x-852380.pdf?src-supplier=Digi-Key; ComponentLink2URL: https://datasheet.ciiva.com/852/csm-7x-852381.pdf?src-supplier=Digi-Key; ComponentLink2Description: https://datasheet.ciiva.com/852/csm-7x-852381.pdf?src-supplier=Digi-Key; ComponentLink3URL: https://datasheet.ciiva.com/852/csm-7x-852382.pdf?src-supplier=Digi-Key; ComponentLink3Description: https://datasheet.ciiva.com/852/csm-7x-852382.pdf?src-supplier=Digi-Key; Supplier Part Number 1: XC1271CT-ND
Y2 = CRYSTAL 32.7680KHZ 12.5PF SMD: Crystal 0.032768MHz ±20ppm (Tol) 12.5pF Flexural 90000Ohm 2-Pin CSMD T/R; Manufacturer: Abracon; Manufacturer Part Number: ABS05-32.768KHZ-T; Designer: Dogukan; ESR (Equivalent Series Resistance): 90kR; Operating Frequency: 32.768 kHz; Supplier 1: Digi-Key; RoHS: Yes; Category: Crystals; Stock 1: 336355; Pricing 1: 1=0,75, 10=0,628, 50=0,565, 100=0,5022, 500=0,4771, 1000=0,40177 (USD); Mount: Surface Mount; Case/Package: CSMD; Number of Pins: 2; Min Operating Temperature: -40°C; Max Operating Temperature: 85°C; Packaging: Tape and Reel; Frequency Tolerance: 20ppm; Load Capacitance: 12.5pF; Package Quantity: 3000; Tolerance: 20ppm; Termination: 2-SMD/SMT; Series Resistance: 90kR; Series: ABS05; Length: 1.6mm; Width: 1mm; Height: 0.5mm; Depth: 1mm; Radiation Hardening: No; Reach SVHC Compliant: No; Lead Free: Lead Free; RoHS Compliant: Yes; ComponentLink1URL: https://datasheet.ciiva.com/23810/abs05-23810480.pdf?src-supplier=Newark; ComponentLink1Description: https://datasheet.ciiva.com/23810/abs05-23810480.pdf?src-supplier=Newark; ComponentLink2URL: https://datasheet.ciiva.com/6728/abs05-6728949.pdf?src-supplier=Digi-Key; ComponentLink2Description: https://datasheet.ciiva.com/6728/abs05-6728949.pdf?src-supplier=Digi-Key; ComponentLink3URL: https://datasheet.ciiva.com/6728/abs05-6728950.pdf?src-supplier=Digi-Key; ComponentLink3Description: https://datasheet.ciiva.com/6728/abs05-6728950.pdf?src-supplier=Digi-Key; ComponentLink4URL: https://datasheet.ciiva.com/16411/abs05-16411149.pdf?src-supplier=Future+Electronics; ComponentLink4Description: https://datasheet.ciiva.com/16411/abs05-16411149.pdf?src-supplier=Future+Electronics; Supplier Part Number 1: 535-11899-1-ND